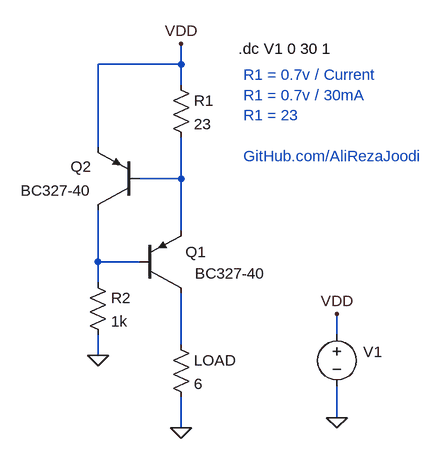
[diagram p0: schematic v1.0.asc]
v1.0.asc, the LTspice schematic file:
Version 4.1
SHEET 1 880 680
WIRE 464 -16 464 -48
WIRE 464 -16 336 -16
WIRE 464 16 464 -16
WIRE 336 112 336 -16
WIRE 464 160 464 96
WIRE 464 160 400 160
WIRE 464 240 464 160
WIRE 336 288 336 208
WIRE 400 288 336 288
WIRE 336 320 336 288
WIRE 704 400 704 368
WIRE 464 416 464 336
WIRE 336 432 336 400
WIRE 704 528 704 480
WIRE 464 544 464 496
FLAG 704 528 0
FLAG 464 544 0
FLAG 336 432 0
FLAG 704 368 VDD
FLAG 464 -48 VDD
SYMBOL voltage 704 384 M0
WINDOW 0 -70 43 Left 2
WINDOW 3 -69 68 Left 2
WINDOW 123 0 0 Left 0
WINDOW 39 0 0 Left 0
SYMATTR InstName V1
SYMATTR Value ""
SYMBOL res 320 304 R0
SYMATTR InstName R2
SYMATTR Value 1k
SYMBOL res 448 0 R0
SYMATTR InstName R1
SYMATTR Value 23
SYMBOL res 448 400 R0
SYMATTR InstName LOAD
SYMATTR Value 6
SYMBOL pnp 400 336 M180
WINDOW 0 103 63 Right 2
WINDOW 3 194 30 Right 2
SYMATTR InstName Q1
SYMATTR Value BC327-40
SYMBOL pnp 400 208 R180
WINDOW 0 106 67 Right 2
WINDOW 3 183 30 Right 2
SYMATTR InstName Q2
SYMATTR Value BC327-40
TEXT 560 0 Left 2 ;R1 = 0.7v / Current\nR1 = 0.7v / 30mA\nR1 = 23\n \nGitHub.com/AliRezaJoodi
TEXT 552 -40 Left 2 !.dc V1 0 30 1

The netlist it stands for:
* v1.0.asc
V1 VDD 0
R2 N002 0 1k
R1 VDD N001 23
R§LOAD N003 0 6
Q1 N003 N002 N001 0 BC327-40
Q2 N002 N001 VDD 0 BC327-40
.model NPN NPN
.model PNP PNP
.lib standard.bjt
* R1 = 0.7v / Current
* R1 = 0.7v / 30mA
* R1 = 23
* GitHub.com/AliRezaJoodi
.dc V1 0 30 1
.backanno
.end